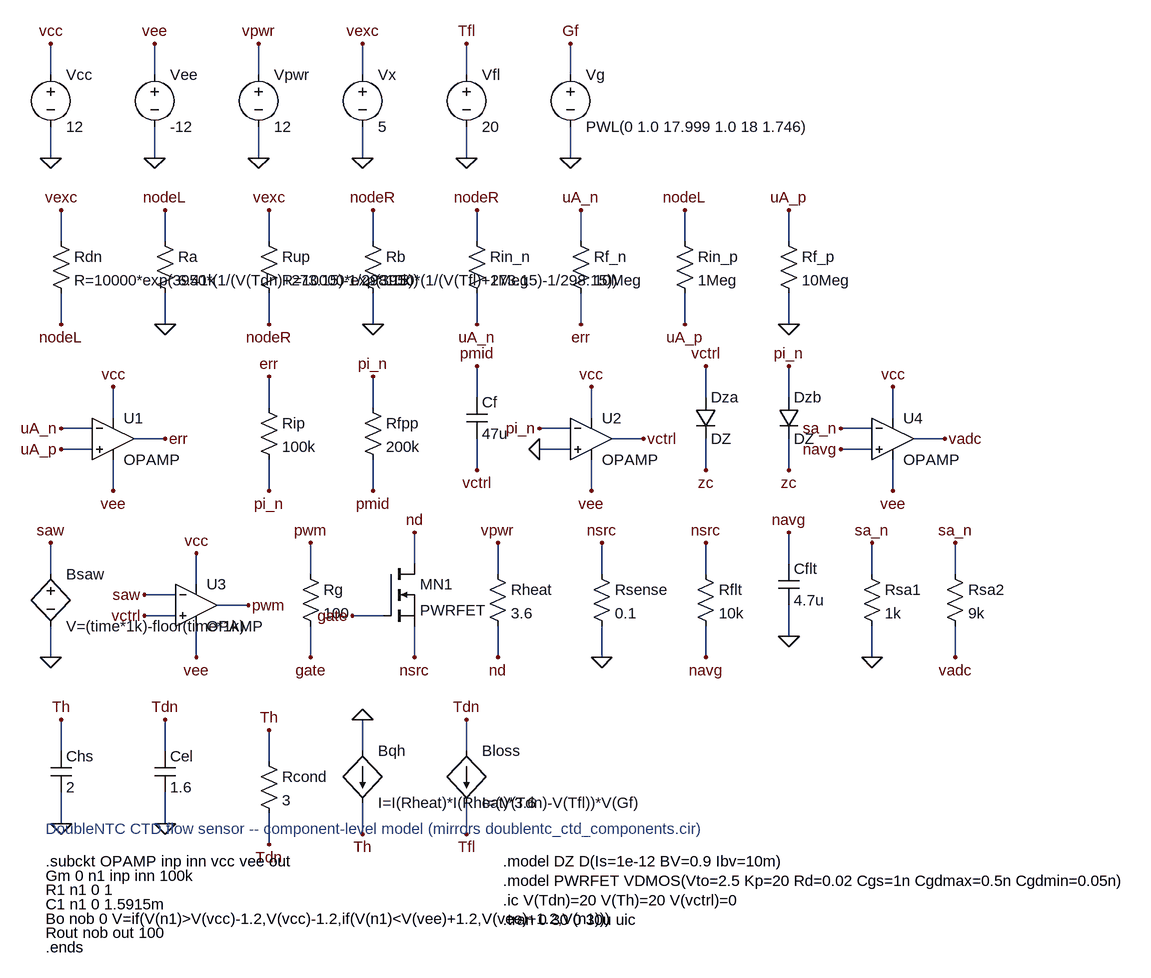
[diagram p0: schematic doublentc_ctd_components.asc]
doublentc_ctd_components.asc, the LTspice schematic file:
Version 4
SHEET 1 1720 1560
WIRE 64 80 64 32
WIRE 64 160 64 208
WIRE 224 80 224 32
WIRE 224 160 224 208
WIRE 384 80 384 32
WIRE 384 160 384 208
WIRE 544 80 544 32
WIRE 544 160 544 208
WIRE 704 80 704 32
WIRE 704 160 704 208
WIRE 864 80 864 32
WIRE 864 160 864 208
WIRE 80 336 80 288
WIRE 80 416 80 464
WIRE 240 336 240 288
WIRE 240 416 240 464
WIRE 400 336 400 288
WIRE 400 416 400 464
WIRE 560 336 560 288
WIRE 560 416 560 464
WIRE 720 336 720 288
WIRE 720 416 720 464
WIRE 880 336 880 288
WIRE 880 416 880 464
WIRE 1040 336 1040 288
WIRE 1040 416 1040 464
WIRE 1200 336 1200 288
WIRE 1200 416 1200 464
WIRE 128 656 80 656
WIRE 128 624 80 624
WIRE 160 608 160 560
WIRE 160 672 160 720
WIRE 192 640 240 640
WIRE 400 592 400 544
WIRE 400 672 400 720
WIRE 560 592 560 544
WIRE 560 672 560 720
WIRE 720 576 720 528
WIRE 720 640 720 688
WIRE 864 656 816 656
WIRE 864 624 816 624
WIRE 896 608 896 560
WIRE 896 672 896 720
WIRE 928 640 976 640
WIRE 1072 576 1072 528
WIRE 1072 640 1072 688
WIRE 1200 576 1200 528
WIRE 1200 640 1200 688
WIRE 1328 656 1280 656
WIRE 1328 624 1280 624
WIRE 1360 608 1360 560
WIRE 1360 672 1360 720
WIRE 1392 640 1440 640
WIRE 64 848 64 800
WIRE 64 928 64 976
WIRE 256 912 208 912
WIRE 256 880 208 880
WIRE 288 864 288 816
WIRE 288 928 288 976
WIRE 320 896 368 896
WIRE 464 848 464 800
WIRE 464 928 464 976
WIRE 624 832 624 784
WIRE 576 912 528 912
WIRE 624 928 624 976
WIRE 752 848 752 800
WIRE 752 928 752 976
WIRE 912 848 912 800
WIRE 912 928 912 976
WIRE 1072 848 1072 800
WIRE 1072 928 1072 976
WIRE 1200 832 1200 784
WIRE 1200 896 1200 944
WIRE 1328 848 1328 800
WIRE 1328 928 1328 976
WIRE 1456 848 1456 800
WIRE 1456 928 1456 976
WIRE 80 1120 80 1072
WIRE 80 1184 80 1232
WIRE 240 1120 240 1072
WIRE 240 1184 240 1232
WIRE 400 1136 400 1088
WIRE 400 1216 400 1264
WIRE 544 1120 544 1072
WIRE 544 1200 544 1248
WIRE 704 1120 704 1072
WIRE 704 1200 704 1248
FLAG 64 32 vcc
FLAG 64 208 0
FLAG 224 32 vee
FLAG 224 208 0
FLAG 384 32 vpwr
FLAG 384 208 0
FLAG 544 32 vexc
FLAG 544 208 0
FLAG 704 32 Tfl
FLAG 704 208 0
FLAG 864 32 Gf
FLAG 864 208 0
FLAG 80 288 vexc
FLAG 80 464 nodeL
FLAG 240 288 nodeL
FLAG 240 464 0
FLAG 400 288 vexc
FLAG 400 464 nodeR
FLAG 560 288 nodeR
FLAG 560 464 0
FLAG 720 288 nodeR
FLAG 720 464 uA_n
FLAG 880 288 uA_n
FLAG 880 464 err
FLAG 1040 288 nodeL
FLAG 1040 464 uA_p
FLAG 1200 288 uA_p
FLAG 1200 464 0
FLAG 80 656 uA_p
FLAG 80 624 uA_n
FLAG 160 560 vcc
FLAG 160 720 vee
FLAG 240 640 err
FLAG 400 544 err
FLAG 400 720 pi_n
FLAG 560 544 pi_n
FLAG 560 720 pmid
FLAG 720 528 pmid
FLAG 720 688 vctrl
FLAG 816 656 0
FLAG 816 624 pi_n
FLAG 896 560 vcc
FLAG 896 720 vee
FLAG 976 640 vctrl
FLAG 1072 528 vctrl
FLAG 1072 688 zc
FLAG 1200 528 pi_n
FLAG 1200 688 zc
FLAG 1280 656 navg
FLAG 1280 624 sa_n
FLAG 1360 560 vcc
FLAG 1360 720 vee
FLAG 1440 640 vadc
FLAG 64 800 saw
FLAG 64 976 0
FLAG 208 912 vctrl
FLAG 208 880 saw
FLAG 288 816 vcc
FLAG 288 976 vee
FLAG 368 896 pwm
FLAG 464 800 pwm
FLAG 464 976 gate
FLAG 624 784 nd
FLAG 528 912 gate
FLAG 624 976 nsrc
FLAG 752 800 vpwr
FLAG 752 976 nd
FLAG 912 800 nsrc
FLAG 912 976 0
FLAG 1072 800 nsrc
FLAG 1072 976 navg
FLAG 1200 784 navg
FLAG 1200 944 0
FLAG 1328 800 sa_n
FLAG 1328 976 0
FLAG 1456 800 sa_n
FLAG 1456 976 vadc
FLAG 80 1072 Th
FLAG 80 1232 0
FLAG 240 1072 Tdn
FLAG 240 1232 0
FLAG 400 1088 Th
FLAG 400 1264 Tdn
FLAG 544 1072 0
FLAG 544 1248 Th
FLAG 704 1072 Tdn
FLAG 704 1248 Tfl
SYMBOL voltage 64 64 R0
SYMATTR InstName Vcc
SYMATTR Value 12
SYMBOL voltage 224 64 R0
SYMATTR InstName Vee
SYMATTR Value -12
SYMBOL voltage 384 64 R0
SYMATTR InstName Vpwr
SYMATTR Value 12
SYMBOL voltage 544 64 R0
SYMATTR InstName Vx
SYMATTR Value 5
SYMBOL voltage 704 64 R0
SYMATTR InstName Vfl
SYMATTR Value 20
SYMBOL voltage 864 64 R0
SYMATTR InstName Vg
SYMATTR Value PWL(0 1.0 17.999 1.0 18 1.746)
SYMBOL res 64 320 R0
SYMATTR InstName Rdn
SYMATTR Value R=10000*exp(3950*(1/(V(Tdn)+273.15)-1/298.15))
SYMBOL res 224 320 R0
SYMATTR InstName Ra
SYMATTR Value 6.41k
SYMBOL res 384 320 R0
SYMATTR InstName Rup
SYMATTR Value R=10000*exp(3950*(1/(V(Tfl)+273.15)-1/298.15))
SYMBOL res 544 320 R0
SYMATTR InstName Rb
SYMATTR Value 10k
SYMBOL res 704 320 R0
SYMATTR InstName Rin_n
SYMATTR Value 1Meg
SYMBOL res 864 320 R0
SYMATTR InstName Rf_n
SYMATTR Value 10Meg
SYMBOL res 1024 320 R0
SYMATTR InstName Rin_p
SYMATTR Value 1Meg
SYMBOL res 1184 320 R0
SYMATTR InstName Rf_p
SYMATTR Value 10Meg
SYMBOL OpAmps\opamp2 160 576 R0
SYMATTR InstName U1
SYMATTR Value OPAMP
SYMBOL res 384 576 R0
SYMATTR InstName Rip
SYMATTR Value 100k
SYMBOL res 544 576 R0
SYMATTR InstName Rfpp
SYMATTR Value 200k
SYMBOL cap 704 576 R0
SYMATTR InstName Cf
SYMATTR Value 47u
SYMBOL OpAmps\opamp2 896 576 R0
SYMATTR InstName U2
SYMATTR Value OPAMP
SYMBOL diode 1056 576 R0
SYMATTR InstName Dza
SYMATTR Value DZ
SYMBOL diode 1184 576 R0
SYMATTR InstName Dzb
SYMATTR Value DZ
SYMBOL OpAmps\opamp2 1360 576 R0
SYMATTR InstName U4
SYMATTR Value OPAMP
SYMBOL bv 64 832 R0
SYMATTR InstName Bsaw
SYMATTR Value V=(time*1k)-floor(time*1k)
SYMBOL OpAmps\opamp2 288 832 R0
SYMATTR InstName U3
SYMATTR Value OPAMP
SYMBOL res 448 832 R0
SYMATTR InstName Rg
SYMATTR Value 100
SYMBOL nmos 576 832 R0
SYMATTR InstName MN1
SYMATTR Value PWRFET
SYMBOL res 736 832 R0
SYMATTR InstName Rheat
SYMATTR Value 3.6
SYMBOL res 896 832 R0
SYMATTR InstName Rsense
SYMATTR Value 0.1
SYMBOL res 1056 832 R0
SYMATTR InstName Rflt
SYMATTR Value 10k
SYMBOL cap 1184 832 R0
SYMATTR InstName Cflt
SYMATTR Value 4.7u
SYMBOL res 1312 832 R0
SYMATTR InstName Rsa1
SYMATTR Value 1k
SYMBOL res 1440 832 R0
SYMATTR InstName Rsa2
SYMATTR Value 9k
SYMBOL cap 64 1120 R0
SYMATTR InstName Chs
SYMATTR Value 2
SYMBOL cap 224 1120 R0
SYMATTR InstName Cel
SYMATTR Value 1.6
SYMBOL res 384 1120 R0
SYMATTR InstName Rcond
SYMATTR Value 3
SYMBOL bi 544 1120 R0
SYMATTR InstName Bqh
SYMATTR Value I=I(Rheat)*I(Rheat)*3.6
SYMBOL bi 704 1120 R0
SYMATTR InstName Bloss
SYMATTR Value I=(V(Tdn)-V(Tfl))*V(Gf)
TEXT 56 1290 Left 2 !.subckt OPAMP inp inn vcc vee out
TEXT 56 1312 Left 2 !Gm 0 n1 inp inn 100k
TEXT 56 1334 Left 2 !R1 n1 0 1
TEXT 56 1356 Left 2 !C1 n1 0 1.5915m
TEXT 56 1378 Left 2 !Bo nob 0 V=if(V(n1)>V(vcc)-1.2,V(vcc)-1.2,if(V(n1)<V(vee)+1.2,V(vee)+1.2,V(n1)))
TEXT 56 1400 Left 2 !Rout nob out 100
TEXT 56 1422 Left 2 !.ends
TEXT 760 1290 Left 2 !.model DZ D(Is=1e-12 BV=0.9 Ibv=10m)
TEXT 760 1320 Left 2 !.model PWRFET VDMOS(Vto=2.5 Kp=20 Rd=0.02 Cgs=1n Cgdmax=0.5n Cgdmin=0.05n)
TEXT 760 1350 Left 2 !.ic V(Tdn)=20 V(Th)=20 V(vctrl)=0
TEXT 760 1380 Left 2 !.tran 0 30 0 30u uic
TEXT 56 1240 Left 2 ;DoubleNTC CTD flow sensor -- component-level model (mirrors doublentc_ctd_components.cir)

The netlist it stands for:
* doublentc_ctd_components.asc
Vcc vcc 0 12
Vee vee 0 -12
Vpwr vpwr 0 12
Vx vexc 0 5
Vfl Tfl 0 20
Vg Gf 0 PWL(0 1.0 17.999 1.0 18 1.746)
Rdn vexc nodeL R=10000*exp(3950*(1/(V(Tdn)+273.15)-1/298.15))
Ra nodeL 0 6.41k
Rup vexc nodeR R=10000*exp(3950*(1/(V(Tfl)+273.15)-1/298.15))
Rb nodeR 0 10k
Rin_n nodeR uA_n 1Meg
Rf_n uA_n err 10Meg
Rin_p nodeL uA_p 1Meg
Rf_p uA_p 0 10Meg
XU1 uA_p uA_n vcc vee err OPAMP  ; pins In+ In- V+ V- OUT
Rip err pi_n 100k
Rfpp pi_n pmid 200k
Cf pmid vctrl 47u
XU2 0 pi_n vcc vee vctrl OPAMP  ; pins In+ In- V+ V- OUT
Dza vctrl zc DZ
Dzb pi_n zc DZ
XU4 navg sa_n vcc vee vadc OPAMP  ; pins In+ In- V+ V- OUT
Bsaw saw 0 V=(time*1k)-floor(time*1k)
XU3 vctrl saw vcc vee pwm OPAMP  ; pins In+ In- V+ V- OUT
Rg pwm gate 100
MN1 nd gate nsrc nsrc PWRFET
Rheat vpwr nd 3.6
Rsense nsrc 0 0.1
Rflt nsrc navg 10k
Cflt navg 0 4.7u
Rsa1 sa_n 0 1k
Rsa2 sa_n vadc 9k
Chs Th 0 2
Cel Tdn 0 1.6
Rcond Th Tdn 3
Bqh 0 Th I=I(Rheat)*I(Rheat)*3.6
Bloss Tdn Tfl I=(V(Tdn)-V(Tfl))*V(Gf)
.model D D
.lib standard.dio
.model NMOS NMOS
.model PMOS PMOS
.lib standard.mos
.subckt OPAMP inp inn vcc vee out
Gm 0 n1 inp inn 100k
R1 n1 0 1
C1 n1 0 1.5915m
Bo nob 0 V=if(V(n1)>V(vcc)-1.2,V(vcc)-1.2,if(V(n1)<V(vee)+1.2,V(vee)+1.2,V(n1)))
Rout nob out 100
.ends
.model DZ D(Is=1e-12 BV=0.9 Ibv=10m)
.model PWRFET VDMOS(Vto=2.5 Kp=20 Rd=0.02 Cgs=1n Cgdmax=0.5n Cgdmin=0.05n)
.ic V(Tdn)=20 V(Th)=20 V(vctrl)=0
.tran 0 30 0 30u uic
* DoubleNTC CTD flow sensor -- component-level model (mirrors doublentc_ctd_components.cir)
.backanno
.end